# EAGLE design motor control pcb (EAGLE 6.2)
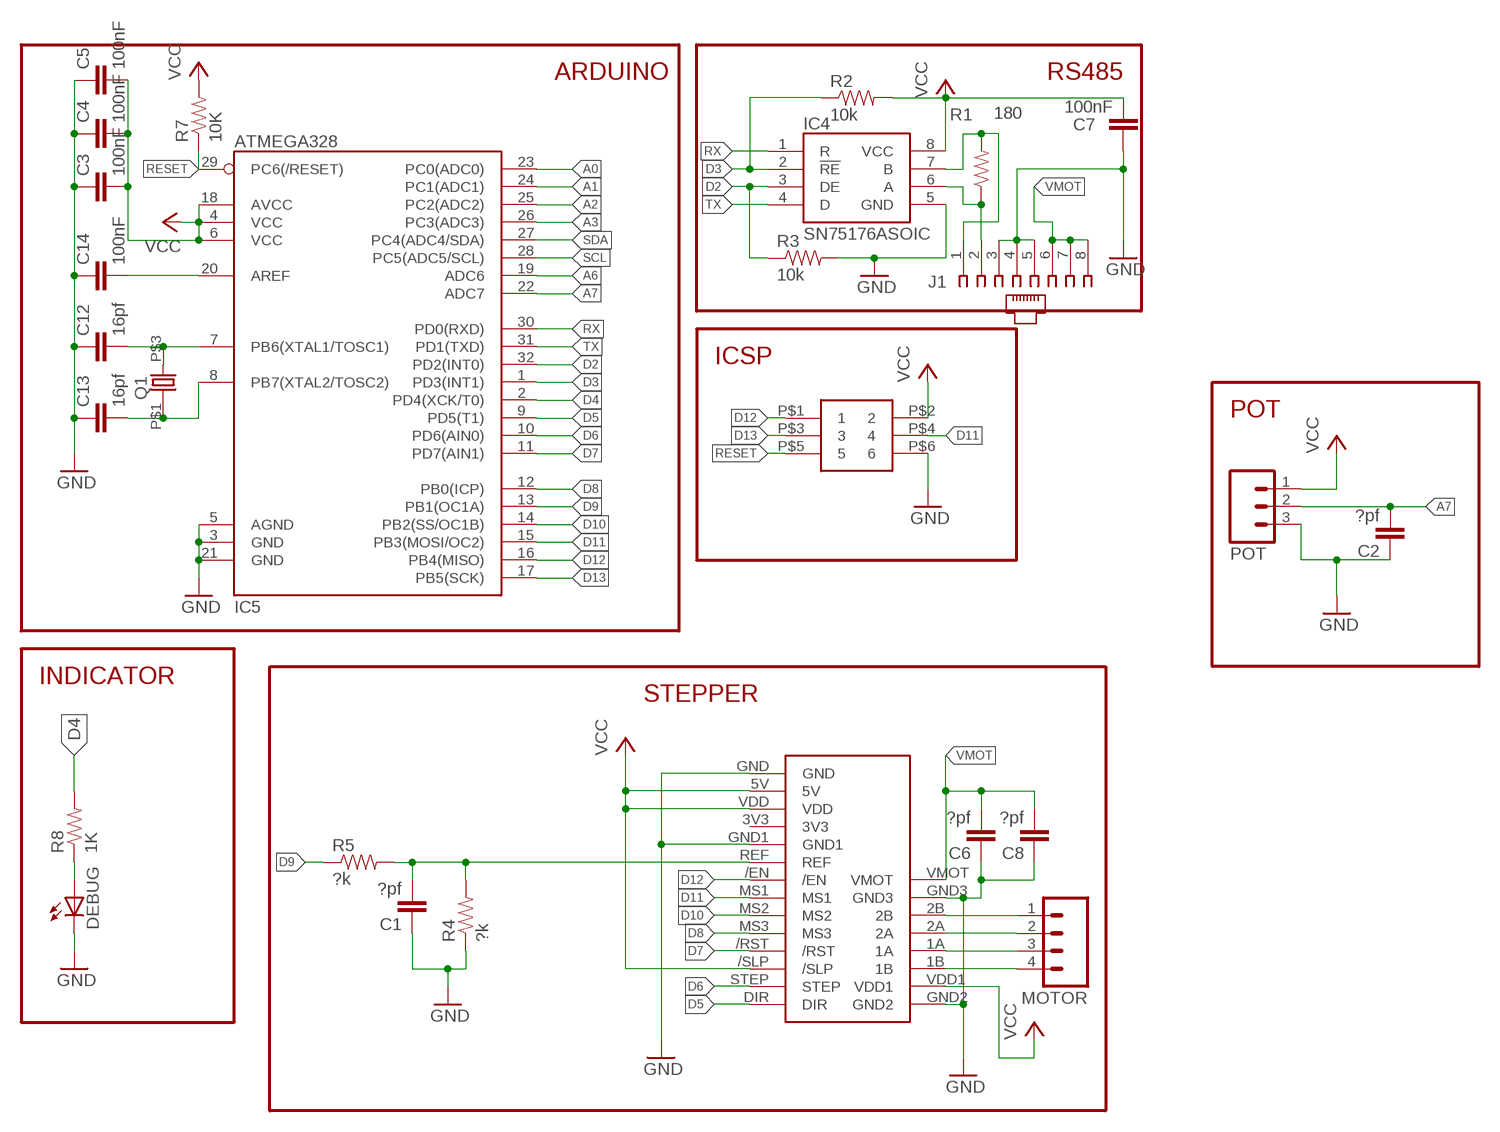
[diagram p0: schematic, sheet 1]

## Parts
C1  ?pf  CAP0805  [0805]
C2  ?pf  CAP0805  [0805]
C3  100nF  CAP0805  [0805]
C4  100nF  CAP0805  [0805]
C5  100nF  CAP0805  [0805]
C6  ?pf  CAP0805  [0805]
C7  100nF  CAP0805  [0805]
C8  ?pf  CAP1210  [1210]
C12  16pf  CAP0805  [0805]
C13  16pf  CAP0805  [0805]
C14  100nF  CAP0805  [0805]
DEBUG  LED0805  [LED-0805]
IC4  SN75176ASOIC  [SO08]
IC5  ATMEGA328  ATMEGA168  [TQFP32-08]
J1  520426-4  [520426-4]
MOTOR  M04PTH  [1X04]
POT  M03PTH  [1X03]
Q1  GLOWBOARD_ABMM2  [GLOWBOARD_ABMM2_CRYSTAL]
R1  180  RESISTOR  [0805]
R2  10k  RESISTOR  [0805]
R3  10k  RESISTOR  [0805]
R4  ?k  RESISTOR  [0805]
R5  ?k  RESISTOR  [0805]
R7  10K  RESISTOR  [0805]
R8  1K  RESISTOR  [0805]
U$1  POLOLU_DRIVER  [POLOLU_DRIVER]
U$2  2X3HEADER  [2X3HEADER]

## Nets
A0: IC5.23(PC0(ADC0))
A1: IC5.24(PC1(ADC1))
A2: IC5.25(PC2(ADC2))
A3: IC5.26(PC3(ADC3))
A6: IC5.19(ADC6)
A7: C2.2 IC5.22(ADC7) POT.2
D2: IC4.3(DE) IC5.32(PD2(INT0)) R3.1
D3: IC4.2(!RE) IC5.1(PD3(INT1)) R2.1
D4: IC5.2(PD4(XCK/T0)) R8.2
D5: IC5.9(PD5(T1)) U$1.DIR
D6: IC5.10(PD6(AIN0)) U$1.STEP
D7: IC5.11(PD7(AIN1)) U$1./RST
D8: IC5.12(PB0(ICP)) U$1.MS3
D9: IC5.13(PB1(OC1A)) R5.1
D10: IC5.14(PB2(SS/OC1B)) U$1.MS2
D11: IC5.15(PB3(MOSI/OC2)) U$1.MS1 U$2.P$4
D12: IC5.16(PB4(MISO)) U$1./EN U$2.P$1
D13: IC5.17(PB5(SCK)) U$2.P$3
GND [power]: C1.1 C2.1 C3.1 C4.1 C5.1 C6.1 C7.1 C8.1 C12.1 C13.1 C14.1 DEBUG.C IC4.5(GND) IC5.3(GND) IC5.5(AGND) IC5.21(GND) J1.3 J1.4 J1.5 POT.3 R3.2 R4.1 U$1.GND U$1.GND1 U$1.GND2 U$1.GND3 U$2.P$6
N$2: MOTOR.1 U$1.2B
N$3: MOTOR.2 U$1.2A
N$4: MOTOR.3 U$1.1A
N$5: MOTOR.4 U$1.1B
N$6: C13.2 IC5.8(PB7(XTAL2/TOSC2)) Q1.P$1
N$8: DEBUG.A R8.1
N$11: C1.2 R4.2 R5.2 U$1.REF
N$20: C14.2 IC5.20(AREF)
N$31: C12.2 IC5.7(PB6(XTAL1/TOSC1)) Q1.P$3
RESET: IC5.29(PC6(/RESET)) R7.1 U$2.P$5
RS485A: IC4.6(A) J1.2 R1.1
RS485B: IC4.7(B) J1.1 R1.2
RX: IC4.1(R) IC5.30(PD0(RXD))
SCL: IC5.28(PC5(ADC5/SCL))
SDA: IC5.27(PC4(ADC4/SDA))
TX: IC4.4(D) IC5.31(PD1(TXD))
VCC: C3.2 C4.2 C5.2 C7.2 IC4.8(VCC) IC5.4(VCC) IC5.6(VCC) IC5.18(AVCC) POT.1 R2.2 R7.2 U$1.5V U$1./SLP U$1.VDD U$1.VDD1 U$2.P$2
VMOT: C6.2 C8.2 J1.6 J1.7 J1.8 U$1.VMOT
Unconnected: U$1.3V3

## Notes on the sheet
- ARDUINO | RS485
- ICSP
- POT
- INDICATOR
- STEPPER

## Library data of the parts
C1-C8 C12-C14 = SparkFun:CAP: Capacitor Standard 0603 ceramic capacitor, and 0.1" leaded capacitor.
DEBUG = SparkFun:LED: LEDs Standard schematic elements and footprints for 5mm, 3mm, 1206, and 0603 sized LEDs. 5mm - Spark Fun Electronics SKU : COM-00529 (and others)
IC4 = reprap:SN75176A
IC5 = SparkFun:ATMEGA168
J1 = con-amp:520426-4: AMP connector
MOTOR = SparkFun:M04: Header 4 Standard 4-pin 0.1" header. Use with straight break away headers (SKU : PRT-00116), right angle break away headers (PRT-00553), swiss pins (PRT-00743), machine pins (PRT-00117), and female headers (PRT-00115). Molex polarized connector foot print use with SKU : PRT-08231 with associated crimp pins and housings. 1MM SMD Version SKU: PRT-10208
POT = SparkFun:M03: Header 3 Standard 3-pin 0.1" header. Use with straight break away headers (SKU : PRT-00116), right angle break away headers (PRT-00553), swiss pins (PRT-00743), machine pins (PRT-00117), and female headers (PRT-00115). Molex polarized connector foot print use with SKU : PRT-08232 with associated crimp pins and housings.
Q1 = blinkyboard:GLOWBOARD_ABMM2: CRYSTAL
R1-R5 R7 R8 = SparkFun:RESISTOR: Resistor Basic schematic elements and footprints for 0603, 1206, and PTH 1/10th watt (small) resistors.
U$1 = sonos_library:POLOLU_DRIVER
U$2 = sonos_library:2X3HEADER

## Net classes
0 default: width 0.305 mm
1 power: width 0.406 mm
2 motors: width 0.61 mm

## Board
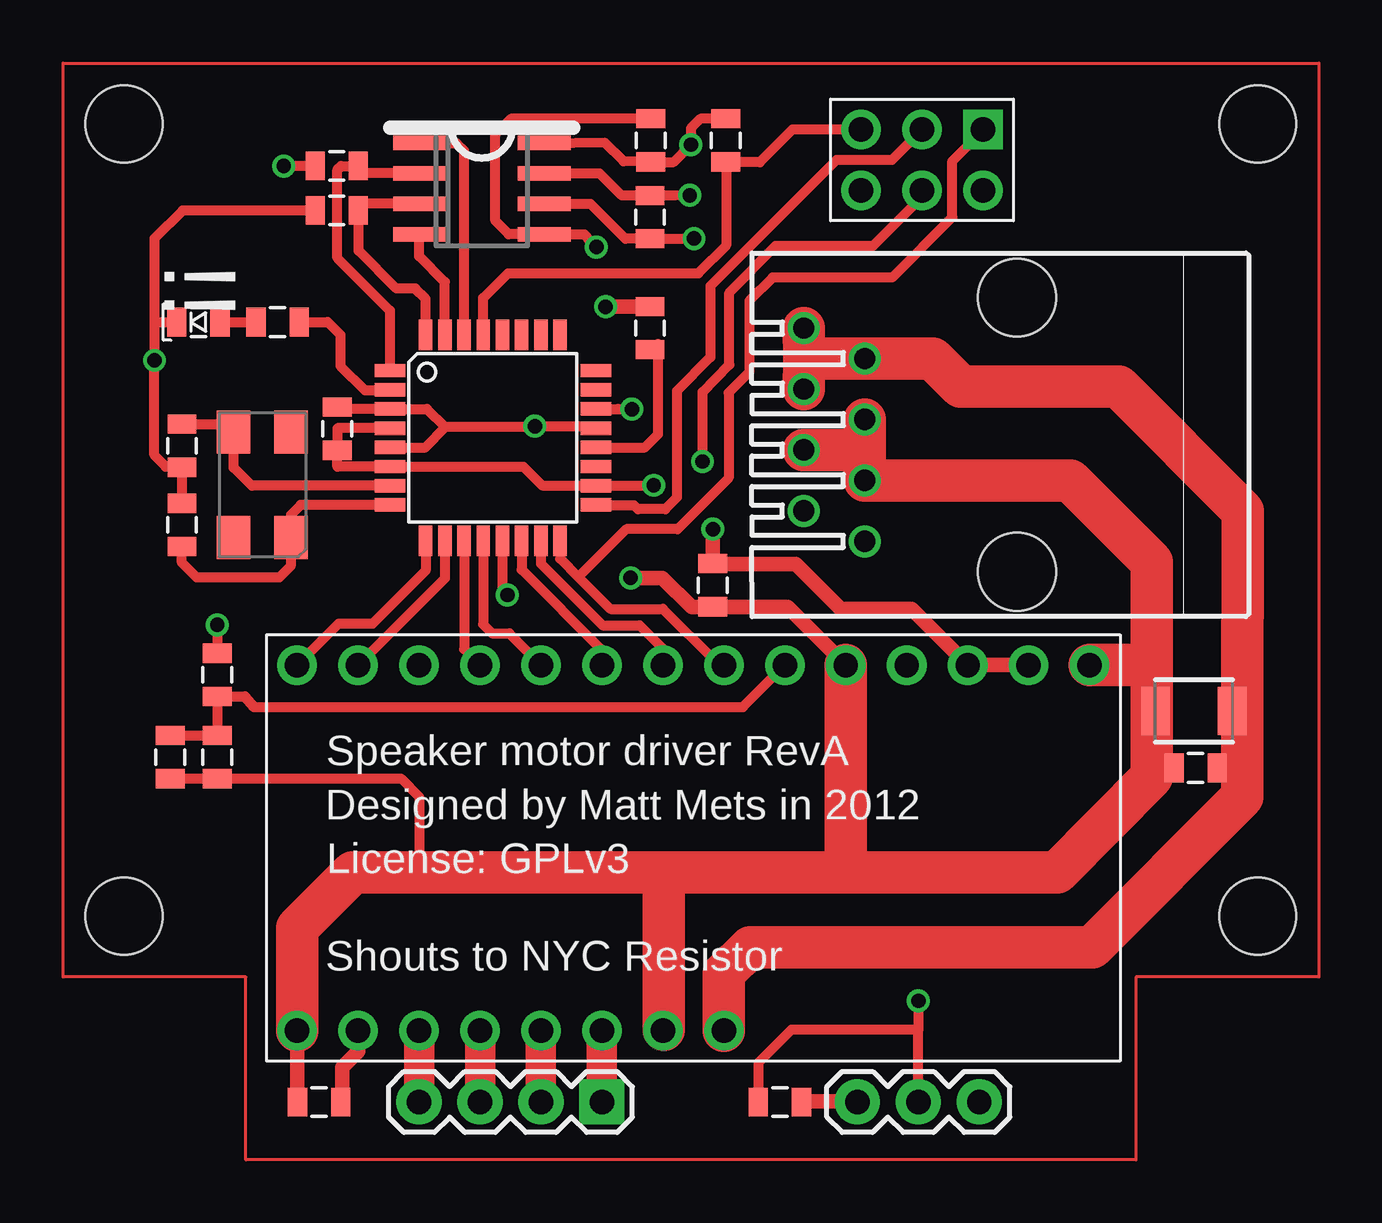
[diagram p1: board, top side]
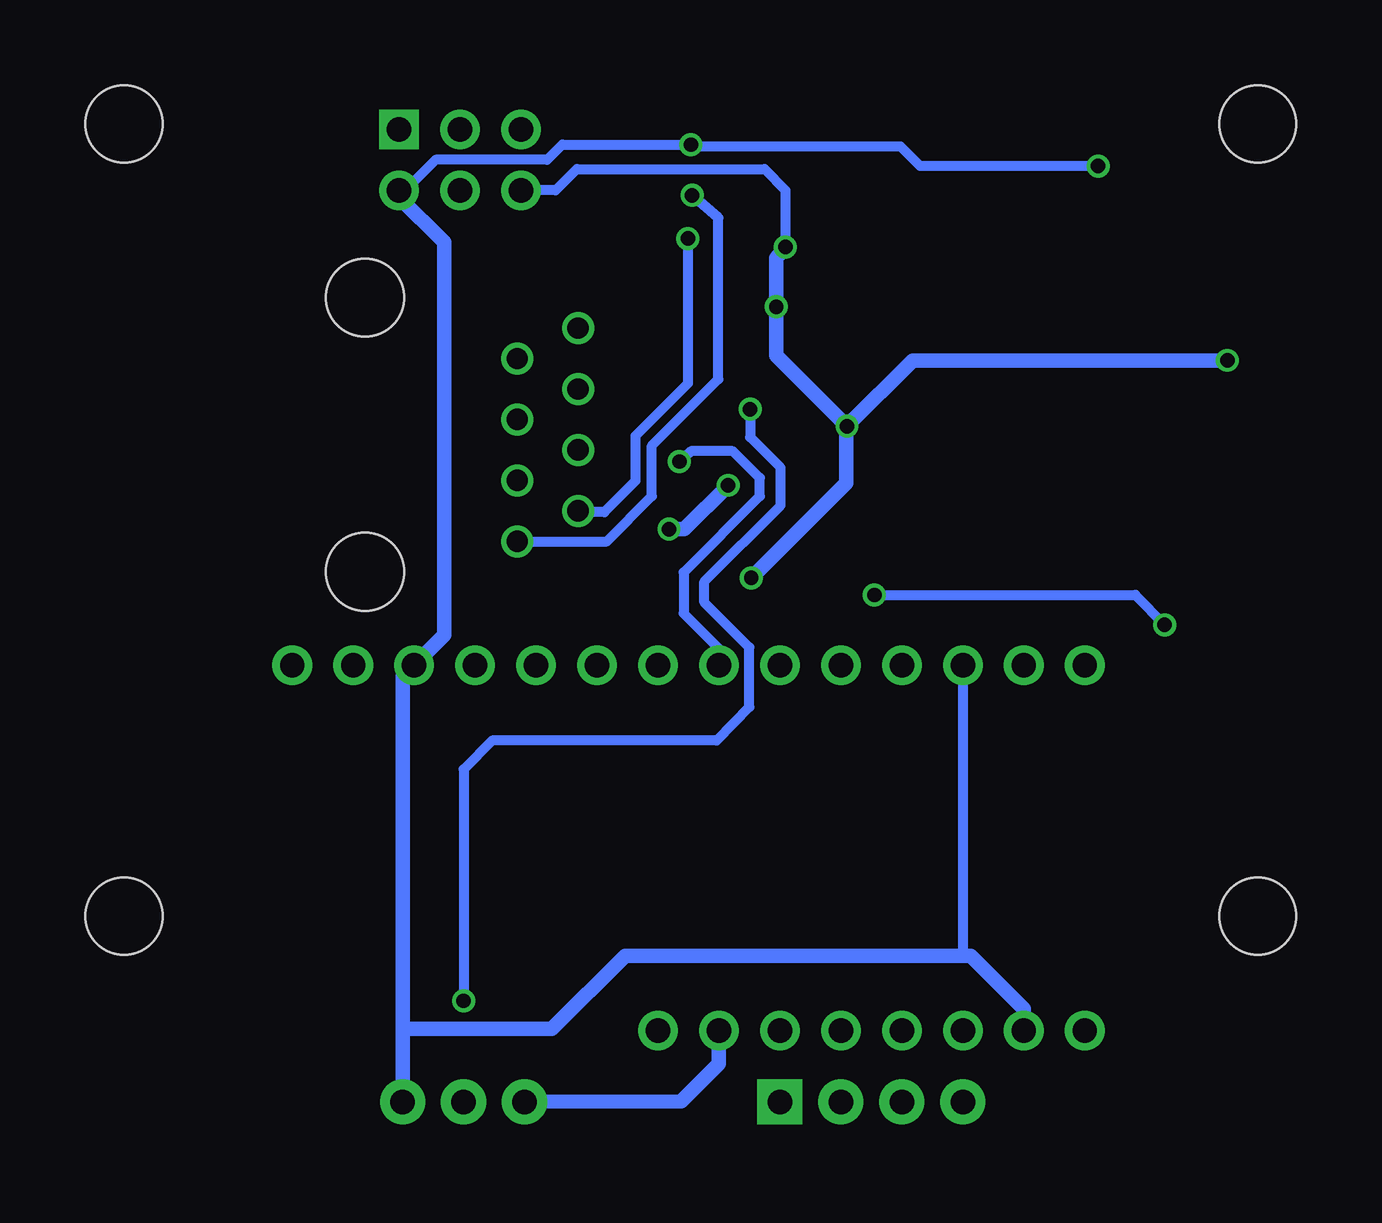
[diagram p2: board, bottom side, seen from below]

No outline drawn. Coordinates in mm, seen from the top.
Copper layers (1*16): Top 0.0356mm / dielectric 1.5011mm / Bottom 0.0356mm
Design rules: minimum track width 6mil, minimum drill 13mil, track to track 6mil, track to pad 6mil, pad to pad 6mil, via to via 6mil, smd to smd 6mil, copper to edge 15mil, drill to drill 6mil, minimum pad ring 7mil, minimum via ring 7mil, stop-mask expansion 4mil, vias tented up to drill 0mil, thermal gap 10mil
Holes 3.2 mm at 49.78,43.18 2.54,43.18 2.54,10.16 49.78,10.16

### Footprints (pad centres in the part's own frame; a part is rotated, then mirrored left to right if it is on the bottom)
0805 = smd 0.8 x 1.2: 1 -0.9,0; 2 0.9,0
1210 = smd 1.2 x 2: 1 -1.6,0; 2 1.6,0
LED-0805 = smd 1.2 x 0.8: A 0,-0.9; C 0,0.9
SO08 = smd 0.6 x 2.2: 1 -1.905,-2.6; 2 -0.635,-2.6; 3 0.635,-2.6; 4 1.905,-2.6; 5 1.905,2.6; 6 0.635,2.6; 7 -0.635,2.6; 8 -1.905,2.6
TQFP32-08 = smd 1.27 x 0.559: 1 -4.293,2.8; 2 -4.293,2; 3 -4.293,1.2; 4 -4.293,0.4; 5 -4.293,-0.4; 6 -4.293,-1.2; 7 -4.293,-2; 8 -4.293,-2.8; 17 4.293,-2.8; 18 4.293,-2; 19 4.293,-1.2; 20 4.293,-0.4; 21 4.293,0.4; 22 4.293,1.2; 23 4.293,2; 24 4.293,2.8 | smd 0.559 x 1.27: 9 -2.8,-4.293; 10 -2,-4.293; 11 -1.2,-4.293; 12 -0.4,-4.293; 13 0.4,-4.293; 14 1.2,-4.293; 15 2,-4.293; 16 2.8,-4.293; 25 2.8,4.293; 26 2,4.293; 27 1.2,4.293; 28 0.4,4.293; 29 -0.4,4.293; 30 -1.2,4.293; 31 -2,4.293; 32 -2.8,4.293
520426-4 = drill 0.889: 1 -4.445,6.35; 2 -3.175,8.89; 3 -1.905,6.35; 4 -0.635,8.89; 5 0.635,6.35; 6 1.905,8.89; 7 3.175,6.35; 8 4.445,8.89 | hole 3.251: -5.715,0; 5.715,0
1X04 = drill 1.016 pad 1.88 square: 1 0,0 | drill 1.016 pad 1.88: 2 2.54,0; 3 5.08,0; 4 7.62,0
1X03 = drill 1.016 pad 1.88: 1 0,0; 2 2.54,0; 3 5.08,0
GLOWBOARD_ABMM2_CRYSTAL = smd 1.8 x 1.4: P$1 -2.1,-1.2; P$2 2.3,-1.2; P$3 2.3,1.2; P$4 -2.1,1.2
POLOLU_DRIVER = drill 1.016 pad 1.651: 1A 16.51,8.89; 1B 16.51,6.35; 2A 16.51,11.43; 2B 16.51,13.97; 3V3 1.27,26.67; 5V 1.27,31.75; /EN 1.27,19.05; /RST 1.27,8.89; /SLP 1.27,6.35; DIR 1.27,1.27; GND 1.27,34.29; GND1 1.27,24.13; GND2 16.51,1.27; GND3 16.51,16.51; MS1 1.27,16.51; MS2 1.27,13.97; MS3 1.27,11.43; REF 1.27,21.59; STEP 1.27,3.81; VDD 1.27,29.21; VDD1 16.51,3.81; VMOT 16.51,19.05
2X3HEADER = drill 1.016 pad 1.651 square: P$1 -1.27,2.54 | drill 1.016 pad 1.651: P$2 1.27,2.54; P$3 -1.27,0; P$4 1.27,0; P$5 -1.27,-2.54; P$6 1.27,-2.54

### Placement (x,y rotation side)
C1  4.47,16.79 90 top
C2  29.87,2.41 180 top
C3  11.43,30.48 270 top
C4  27.08,23.95 90 top
C5  10.67,2.41 0 top
C6  47.19,16.33 0 top
C7  24.49,42.49 270 top
C8  47.12,18.72 0 top
C12  4.95,29.77 90 top
C13  4.95,26.47 270 top
C14  24.46,34.67 270 top
DEBUG  5.64,34.92 90 top
IC4  17.45,40.49 270 top
IC5  17.91,30.1 0 top
J1  39.75,30.23 90 top
MOTOR  22.45,2.41 180 top
POT  38.18,2.41 180 top
Q1  8.31,28.04 90 top
R1  24.46,39.29 90 top
R2  11.4,41.43 180 top
R3  11.4,39.57 180 top
R4  6.43,16.79 90 top
R5  6.43,20.22 270 top
R7  27.61,42.49 90 top
R8  8.94,34.92 0 top
U$1  8.48,21.89 270 top
U$2  35.79,41.68 270 top

### Tracks (layer width: path | path; a pad name or v marks a point on that pad's centre or on a via)
A7  (via drill 0.6)
  Top 0.406: POT.2 35.64,5.44 | IC5.22 23.12,31.3 v23.7,31.29 | v35.64,6.63 35.64,5.44 | 35.64,5.44 30.35,5.44 28.97,4.05 C2.2
  Bottom 0.406: v35.64,6.63 35.64,16.28 34.44,17.48 25.09,17.48 23.72,18.87 23.72,21.36 25.6,23.24 25.6,24.11 22.43,27.28 22.43,28.85 23.7,30.12 v23.7,31.29
D2
  Top 0.406: IC4.3 12.58,39.85 R3.1 12.32,39.56 12.32,37.9 13.89,36.32 14.68,36.32 15.11,35.9 IC5.32
D3
  Top 0.406: IC4.2 12.61,41.12 R2.1 11.58,41.43 11.43,41.27 11.43,37.59 13.61,35.41 IC5.1
D4
  Top 0.406: R8.2 11.02,34.92 11.56,34.39 11.56,33.1 12.57,32.08 13.6,32.08 IC5.2
D5
  Top 0.406: IC5.9 15.11,24.56 12.9,22.35 11.48,22.35 U$1.DIR
D6
  Top 0.406: IC5.10 15.91,24.24 U$1.STEP
D7
  Top 0.406: IC5.11 16.71,21.29 U$1./RST
D8
  Top 0.406: IC5.12 17.51,22.32 17.88,21.95 18.59,21.95 U$1.MS3
D9  (via drill 0.6)
  Top 0.406: IC5.13 18.31,23.79 v18.52,23.55 | v6.43,22.3 R5.1
  Bottom 0.406: v18.52,23.55 7.64,23.55 v6.43,22.3
D10
  Top 0.406: U$1.MS2 22.45,21.26 19.11,24.61 IC5.14
D11  (via drill 0.6)
  Top 0.406: 24.97,20.65 U$1.MS1 24.99,21.31 24.03,22.28 22.48,22.28 19.91,24.85 IC5.15 | v26.64,29.11 26.64,32 27.76,33.15 27.76,36.14 29.69,38.1 33.76,38.1 35.79,40.13 U$2.P$4
  Bottom 0.406: v26.64,29.11 26.16,29.54 24.41,29.54 23.29,28.42 23.29,27.66 26.47,24.49 26.47,22.78 24.99,21.31 U$1.MS1
D12
  Top 0.406: U$1./EN 27.18,20.8 24.99,22.96 22.81,22.96 21.48,24.3 | IC5.16 20.71,25.06 21.48,24.3 | U$2.P$1 38.33,42.9 37.06,41.63 37.06,39.29 34.54,36.78 29.57,36.78 28.6,35.81 28.6,32.84 27.74,31.98 27.74,28.42 25.6,26.29 23.47,26.29 21.48,24.3
D13
  Top 0.406: IC5.17 22.22,27.28 23.8,27.28 23.95,27.13 25.09,27.13 25.58,27.61 25.58,32.05 26.98,33.45 26.98,36.42 32.23,41.68 34.54,41.68 35.79,42.93 U$2.P$3
GND  (via drill 0.6)
  Top 0.406: C13.1 C12.1 4.28,28.89 3.81,29.39 v3.81,33.33 3.81,34.92 | 24.97,5.36 U$1.GND3 25.02,5.41 | 33.09,2.45 POT.3 | 3.81,34.92 DEBUG.C | v22.23,38.05 21.72,38.58 IC4.5 18.57,38.58 18.01,39.14 18.01,42.75 18.66,43.39 C7.1 | 15.95,30.56 15.9,30.56 15.16,31.3 IC5.3 11.43,31.3 C3.1 | IC5.21 22.14,30.56 19.68,30.56 v19.66,30.58 19.63,30.56 15.95,30.56 | IC5.5 15.09,29.7 15.95,30.56 | 32.63,20.64 U$1.GND1 | 9.91,8.48 9.75,8.33 | 9.79,5.34 U$1.GND2 | 31.06,2.45 C2.1 | 14.96,11.99 14.83,12.12 14.83,15.14 14.08,15.89 R4.1 C1.1 | 45.03,18.11 45.36,17.78 | 3.81,34.92 3.81,38.41 4.98,39.57 R3.2
  Top 0.61: 33.09,2.45 31.06,2.45 | U$1.GND1 30.19,23.05 C4.1 27.06,23.04 26.19,23.04 24.97,24.26 v23.65,24.26 | C5.1 9.77,5.37 U$1.GND2 | C6.1 45.39,16.48 45.36,16.46 | C8.1 45.52,18.44 45.36,18.29 | C14.1 22.64,35.57 v22.61,35.56
  Top 1.778: J1.5 33.4,29.59 | J1.4 33.4,29.59 | 33.4,29.59 J1.3 41.96,28.32 45.36,24.92 45.36,20.52 | U$1.GND2 9.75,8.33 9.75,9.68 12.06,11.99 14.96,11.99 25.45,11.99 | 45.36,20.52 45.36,18.29 45.36,17.78 45.36,16.46 45.36,15.95 41.43,11.99 32.44,11.99 | 32.44,11.99 25.45,11.99 | 25.02,5.41 25.02,11.56 25.45,11.99 | U$1.GND 45.26,20.62 45.36,20.52 | U$1.GND1 32.61,12.17 32.44,11.99
  Bottom 0.406: v22.23,38.05 22.23,40.41 23.09,41.3 30.91,41.3 31.8,40.41 U$2.P$6
  Bottom 0.61: v22.23,38.05 22.61,37.59 v22.61,35.56 22.61,33.53 v19.66,30.58 | POT.3 26.57,2.44 24.99,4.01 U$1.GND3 | v19.66,30.58 19.68,30.56 19.68,28.22 v23.65,24.26 | v3.81,33.33 16.92,33.33 v19.66,30.58
N$2
  Top 1.27: MOTOR.1 U$1.2B
N$3
  Top 1.27: MOTOR.2 U$1.2A
N$4
  Top 1.27: MOTOR.3 U$1.1A
N$5
  Top 1.27: MOTOR.4 U$1.1B
N$6
  Top 0.406: Q1.P$1 9.48,24.75 9.02,24.28 5.56,24.28 4.95,24.89 C13.2 | 9.52,25.93 Q1.P$1 | IC5.8 9.9,27.3 9.5,26.9 Q1.P$1
N$7
  Top 0.127: 0,7.62 0,45.72 52.32,45.72 52.32,7.62 44.7,7.62 44.7,0 7.62,0 7.62,7.62 0,7.62
N$8
  Top 0.406: DEBUG.A R8.1
N$11
  Top 0.406: 30.1,20.6 U$1.REF 28.32,18.87 7.95,18.87 7.58,19.32 R5.2 R4.2 C1.2
N$20
  Top 0.406: IC5.20 24.24,29.7 24.79,30.25 24.79,34.02 C14.2
N$31
  Top 0.406: 7.11,30.67 Q1.P$3 | Q1.P$3 7.11,28.85 7.87,28.1 IC5.7 | C12.2 6.78,30.67 Q1.P$3
RESET
  Top 0.406: IC5.29 17.51,35.92 18.54,36.96 26.47,36.96 27.62,38.11 27.62,41.58 | 27.62,41.58 29.03,41.58 30.4,42.95 U$2.P$5 | 27.62,41.58 R7.1
RS485A  (via drill 0.6)
  Top 0.406: IC4.6 21.97,39.85 23.43,38.39 R1.1 25.44,38.39 v26.29,38.41
  Bottom 0.406: v26.29,38.41 26.29,32.36 28.47,30.18 28.47,28.3 29.77,27 30.81,27 J1.2
RS485B  (via drill 0.6)
  Top 0.406: IC4.7 22.35,41.12 23.28,40.19 R1.2 25.49,40.19 v26.11,40.21
  Bottom 0.406: J1.1 29.67,25.78 27.79,27.66 27.79,29.77 25.02,32.54 25.02,39.27 v26.11,40.21
RX
  Top 0.406: IC5.30 16.71,42.07 16.41,42.37 14.88,42.37 IC4.1
TX
  Top 0.406: IC5.31 15.91,36.59 14.83,37.67 14.83,38.57 IC4.4
VCC  (via drill 0.6)
  Top 0.406: IC4.8 20.07,42.37 22.58,42.39 23.35,41.62 C7.2 25.44,41.59 v26.16,42.32 | 37.77,20.55 U$1.VDD | 11.63,2.86 C5.2 | 26.14,42.34 v26.16,42.32 | 26.19,42.34 v26.16,42.32 | R2.2 v9.2,41.43 | v24.61,28.12 24.59,28.1 IC5.18 22.18,28.12 19.96,28.12 19.18,28.9 IC5.6 11.43,28.9 C3.2 11.43,30.5 IC5.4 | R7.2 26.55,43.39 26.16,43 v26.16,42.32
  Top 0.61: U$1.5V U$1.VDD 35.36,22.96 32.41,22.96 30.53,24.84 C4.2 v27.08,26.29 | U$1.VDD1 12.29,4.52 11.63,3.86 11.63,2.86
  Bottom 0.406: 38.02,5.46 38.18,5.31 | v9.2,41.43 16.61,41.43 17.42,42.24 26.09,42.24 v26.16,42.32 31.52,42.32 32.16,41.68 36.8,41.68 38.08,40.41 U$2.P$2 38.33,40.13 | U$1./SLP 14.83,8.59 14.76,8.51
  Bottom 0.61: v24.61,28.12 26.44,26.29 v27.08,26.29 | POT.1 38.18,5.31 38.18,20.14 U$1.VDD 36.45,21.87 36.45,38.25 38.33,40.13 | U$1.VDD1 12.29,6.3 14.5,8.51 14.76,8.51 28.91,8.51 31.95,5.46 38.02,5.46
VMOT
  Top 0.61: C8.2 48.72,18.42 49.13,18.01 | C6.2 48.85,16.48 49.13,16.2
  Top 1.778: 30.89,33.4 J1.6 | J1.8 30.89,33.4 | 30.89,33.4 J1.7 36.25,33.4 37.41,32.23 43.99,32.23 49.15,27.05 49.13,18.01 49.13,16.2 49.12,15.14 42.88,8.87 28.63,8.87 27.53,7.77 U$1.VMOT

### Text on the board
tNames: !! | Speaker motor driver RevA | Designed by Matt Mets in 2012 | License: GPLv3 | Shouts to NYC Resistor